# Altium schematic sheet CukSupply_Sch.SchDoc
size B; Organization: ORGANIZATION; Address1: ADDRESS 1; Address2: ADDRESS 2; Address3: ADDRESS 3; Address4: ADDRESS 4; Revision: -; SheetNumber: 2; SheetTotal: 2; ENG_APP_DATE: --/--/--; DSN_APP_DATE: --/--/--; CHK_APP_DATE: --/--/--
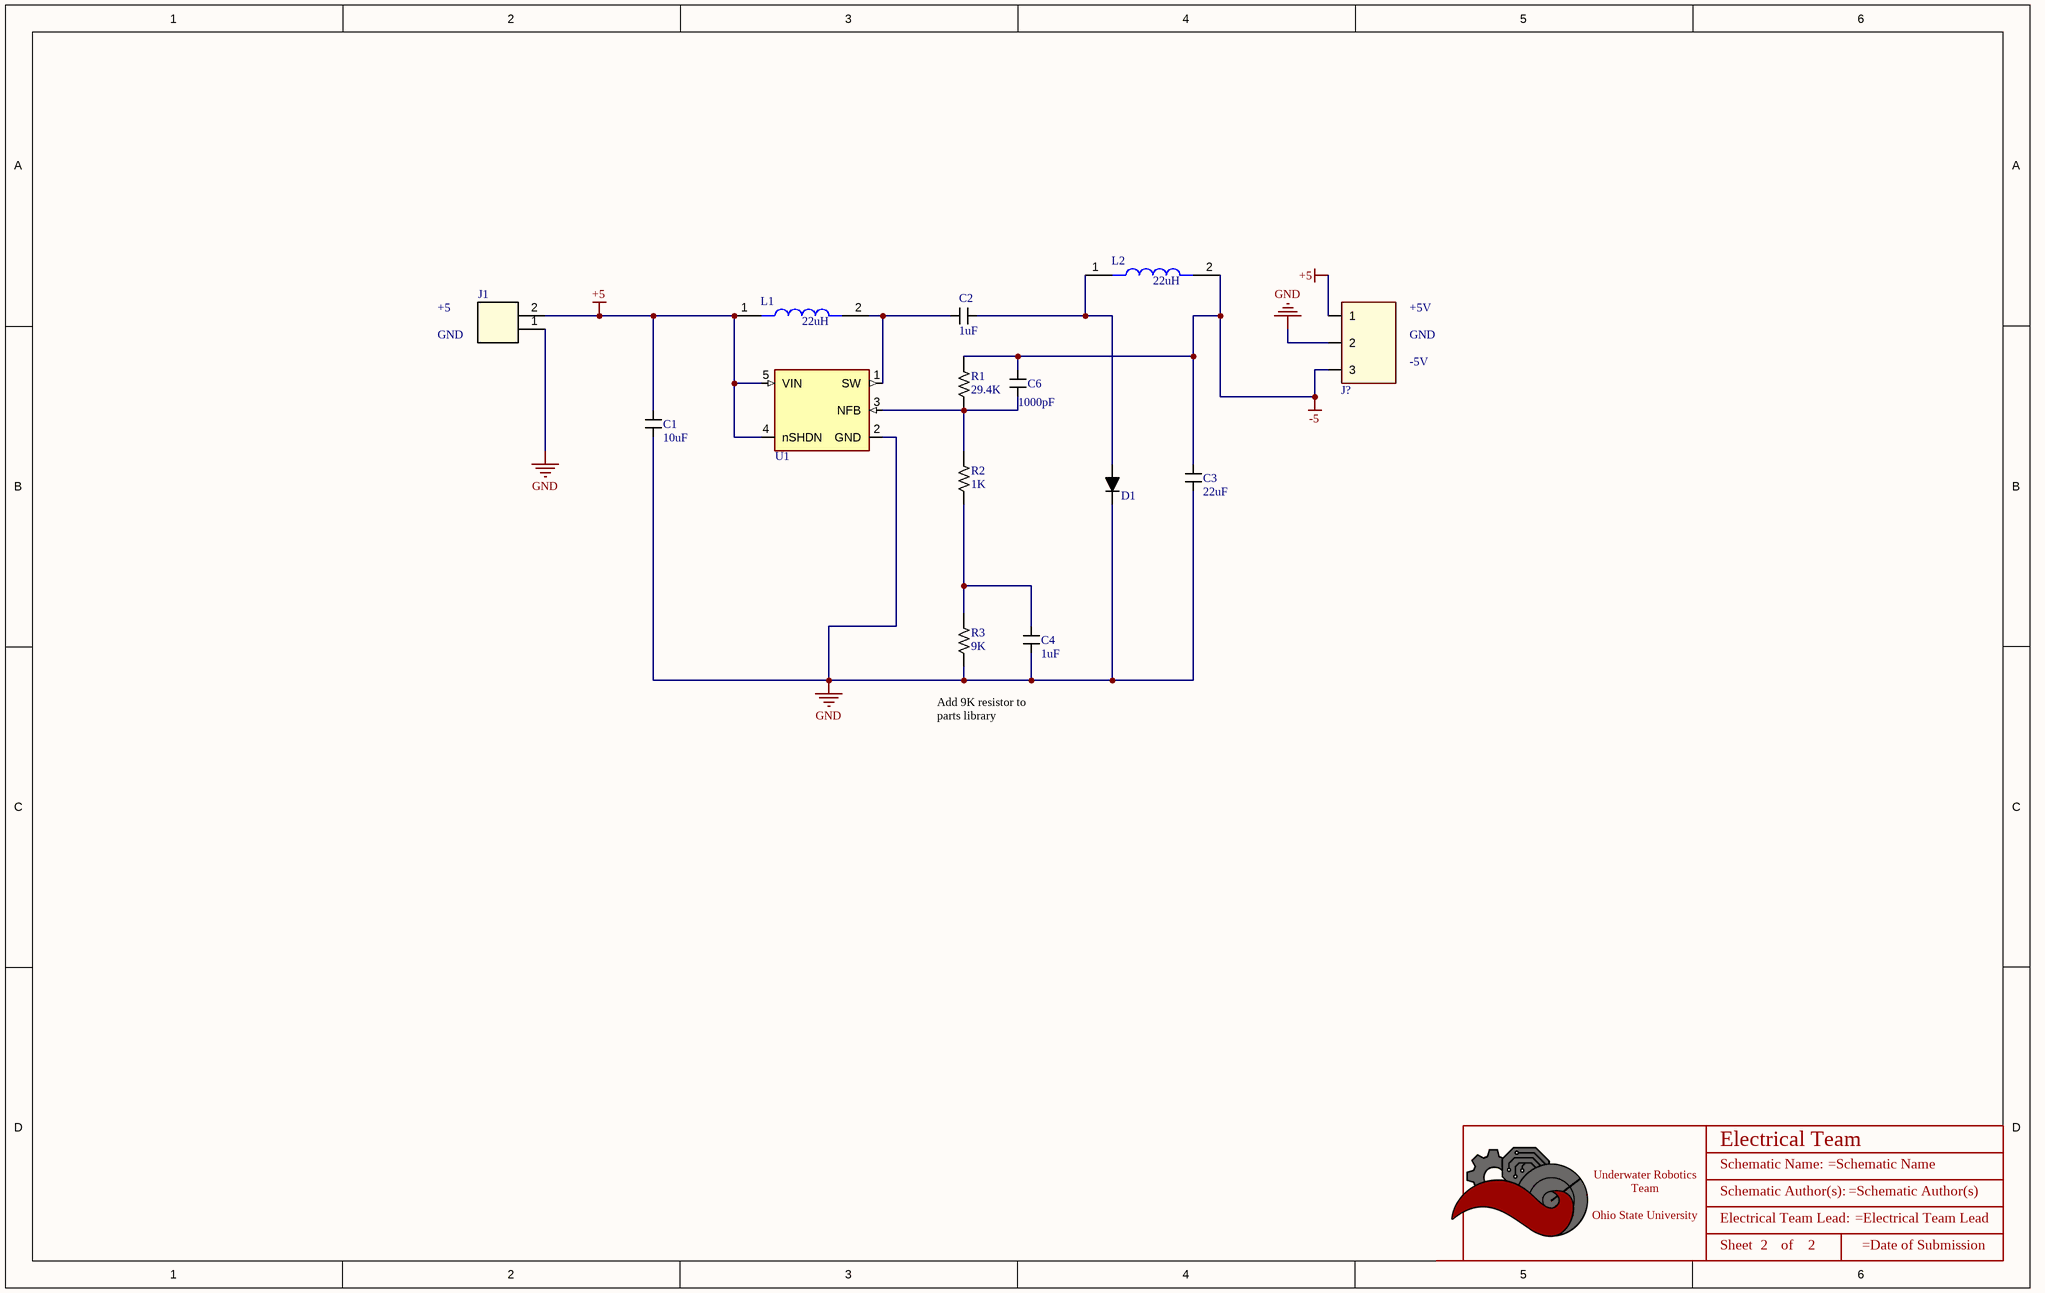
[diagram p0: CukSupply_Sch.SchDoc]

## Parts
*  Title_Block  (value not drawn)  (graphical)
C1  Value (uF): 10uF  [CAPACITOR_0603]  (hidden comment: 10uF Ceramic 6.3V)
C2  value 1uF  [CAPACITOR_0603]  (hidden comment: 1uF Ceramic 16V)
C3  value 22uF  [CAPACITOR_0603]  (hidden comment: 22uF Ceramic)
C4  value 1uF  [CAPACITOR_0603]  (hidden comment: 1uF Ceramic 16V)
C6  value 1000pF  [CAPACITOR_0603]  (hidden comment: CAPACITOR_1000pF_0603)
D1  MBR0520LT3G  [SOD-123]  (value not drawn)
J1  B2B-XH-A(LF)(SN)  [CONN_B2B-XH-A(LF)(SN)_JST]  (value not drawn)
J?  CONN_MOLEX_MINIFIT_JR_3POS  [HEADER_3PIN_4.2MM]  (value not drawn)
L1  value 22uH  [INDUCTOR_0630-220MC]  (hidden comment: INDUCTOR_22uH_)
L2  value 22uH  [INDUCTOR_0630-220MC]  (hidden comment: INDUCTOR_22uH_)
R1  Value  (Ohms): 29.4K  [RESISTOR_0603]  (hidden comment: 29.4k Ohm 1% 1/10W)
R2  Value  (Ohms): 1K  [RESISTOR_0603]  (hidden comment: 1k Ohm 5% 1/8W)
R3  Value  (Ohms): 9K  [RESISTOR_0603]  (hidden comment: 9k Ohm 5% 1/10W)
U1  LM2611 -5V Regulator  [SOT-23-5]  (value not drawn)

## Nets
+5: C1.1 J1.2 J?.1 L1.1 U1.4(nSHDN) U1.5(VIN)
-5: C3.1 C6.1 J?.3 L2.2 R1.1
GND: C1.2 C3.2 C4.2 D1.2 J1.1 J?.2 R3.2 U1.2(GND)
NetC2_1: C2.1 D1.1 L2.1
NetC2_2: C2.2 L1.2 U1.1(SW)
NetC4_1: C4.1 R2.2 R3.1
NetC6_2: C6.2 R1.2 R2.1 U1.3(NFB)

## Notes on the sheet
- +5
- GND
- +5V
- -5V
- Add 9K resistor to parts library
- DWG. NO.
- REV.
- SHT.
- THIS DOCUMENT AND THE DATA DISCLOSED HEREIN OR HEREWITH IS THE PROPERTY OF ALTIUM LIMITED AND MAY BE FREELY DISTRIBUTED IN WHOLE. NO RIGHTS ARE RESERVED OR EXPRESS OR IMPLIED WARANTEE GIVEN.
- REVISION
- DESCRIPTION
- DATE
- APPROVED
- ENG:
- APPROVALS
- PROJECT
- DSN:
- CHK:
- REFERENCE DOCUMENTS
- PROJECT REVISION:
- TITLE
- DOCUMENT REVISION:
- DESIGN ITEM:
- BOM:
- FAB DWG:
- PCB DWG:
- ASSY DWG:
- SCALE:
- SIZE
- B
- CAGE CODE
- FILE NAME
- DWG NO.
- SHEET
- OF
- REV
- (in symbol Title_Block) Electrical Team; Schematic Name:; Schematic Author(s):; Underwater Robotics Team / Ohio State University; Electrical Team Lead:; Sheet; of

## Library data of the parts
* = Title_Block: UWRT Schematic Title Block Template / Created June 2021, Dylan Trainor
C1 = CAPACITOR_10uF_0603: Cap 10uF 6.3V +/-20% / Ceramic 0603; Made By: Flip B; ComponentLink1Description: Digikey; ComponentLink1URL: https://www.digikey.com/en/products/detail/samsung-electro-mechanics/CL10A106MQ8NNNC/3886777; Supplier 1: Digi-Key; Supplier Part Number 1: 1276-1119-1-ND; Tolerance: +/- 20%; Voltage: 6.3V
C2 C4 = CAPACITOR_1uF_0603: Cap 1uF 16V +/-10% / Ceramic 0603; Made By: Flip B; Tolerance: +/- 10%; Voltage: 16V; Supplier 1: Digi-Key; Supplier Part Number 1: 399-7847-1-ND
C3 = CAPACITOR_22uF_0603: Cap 22uF 6.3V +/-20% / Ceramic 0603; Made By: Flip B; Tolerance: +/- 20%; Voltage: 6.3V; Supplier 1: Digi-Key; Supplier Part Number 1: 445-8028-1-ND
C6 = CAPACITOR_1000pF_0603: CAP 1000 pF 16V ±10% 0603
D1 = SCHOTTKY_20V_500mA: Schottky Diode, 20V reverse breakdown, 500mA, Vf = 0.385V; Made By: Flip B; ComponentLink1Description: Datasheet; ComponentLink1URL: https://www.onsemi.com/pdf/datasheet/mbr0520lt1-d.pdf; Forward Voltage: 0.385V; Forward Current: 500mA; Package: SOD-123; Supplier 1: Digi-Key; Supplier Part Number 1: MBR0520LT3GOSCT-ND
J1 = B2B-XH-A(LF)(SN): CONN HEADER VERT 2POS 2.5MM; Vendor: JST; Built_By: EMA_Cory; SourceLibrary: JST_2019-12-02; Manufacturer_Part_Number: B2B-XH-A(LF)(SN); Copyright: Copyright (C) 2018 Accelerated Designs. All rights reserved; RefDes: RefDes; Type: DEV; Supplier 1: Digi-Key; Supplier Part Number 1: 455-2247-ND; Created By: Dylan Trainor; Verified By: *
J? = CONN_MOLEX_MINIFIT_JR_3POS: Connector Header Through Hole, Right Angle 3 position 0.165" (4.20mm)
L1 L2 = INDUCTOR_22uH_: 22µH Inductor 3A 135mOhm Max Nonstandard; MF: ECS Inc.; MP: ECS-MPIL0630-220MC; Digi-Key_Part_Number: XC2409CT-ND; SnapEDA_Link: https://www.snapeda.com/parts/ECS-MPIL0630-220MC/ECS%20Inc./view-part/3624015/?ref=snap; Check_prices: https://www.snapeda.com/parts/ECS-MPIL0630-220MC/ECS%20Inc./view-part/3624015/?ref=eda; Purchase-URL: https://pricing.snapeda.com/search/part/ECS-MPIL0630-220MC/?ref=eda; Package: Nonstandard ECS Inc.
R1 = RESISTOR_29.4k_0603: RES 29.4k OHM 1% 1/10W 0603; Tolerance: +/- 1%; Made By: Flip B; ComponentLink1Description: Digikey; ComponentLink1URL: https://www.yageo.com/upload/media/product/productsearch/datasheet/rchip/PYu-RC_Group_51_RoHS_L_11.pdf; Wattage: 1/10W; Supplier 1: Digi-Key; Supplier Part Number 1: 311-29.4KHRCT-ND
R2 = RESISTOR_1K_0603: RES 1k OHM 5% 1/8W 0603; Tolerance: +/- 5%; Made By: Robert Pafford; ComponentLink1Description: Datasheet; ComponentLink1URL: https://www.bourns.com/docs/product-datasheets/CRxxxxx.pdf; Wattage: 1/8W; Supplier: Digikey; Digikey Part Numer: CR0603-JW-104ELFTR-ND; Supplier 1: Digi-Key; Supplier Part Number 1: 2019-RK73B1JTTD102JCT-ND
R3 = RESISTOR_10K_0603: RES 9k OHM 5% 1/10W 0603; Tolerance: +/- 5%; Wattage: 1/8W; Made By: Robert Pafford; ComponentLink1Description: Datasheet; ComponentLink1URL: https://www.bourns.com/docs/product-datasheets/CRxxxxx.pdf; Supplier: Digikey; Digikey Part Numer: CR0603-JW-104ELFTR-ND; Supplier 1: Digi-Key; Supplier Part Number 1: 2019-RK73B1JTTD103JCT-ND
U1 = LM2611BMFX/NOPB: 900-mA -5Vswitching voltage regulator 1.4MHz SOT23-5; Made By: Flip B; Input Voltage: 2.7V-14V; Output Voltage: -1.23V - -22V; Output Current: 900mA; Varified By: *; Switching Frequency: 1.4MHz; Supplier 1: Digi-Key; Supplier Part Number 1: 296-35161-1-ND